# Altium schematic sheet SFP_10GbE_Port0.SchDoc: =ProjectTitle
size A3; Author: Jaime I. Chait; Organization: NWES LLC; Address1: 111 SW 5th Ave, STE 3150; Address2: Portland, OR 97204; SheetNumber: 17; SheetTotal: 19
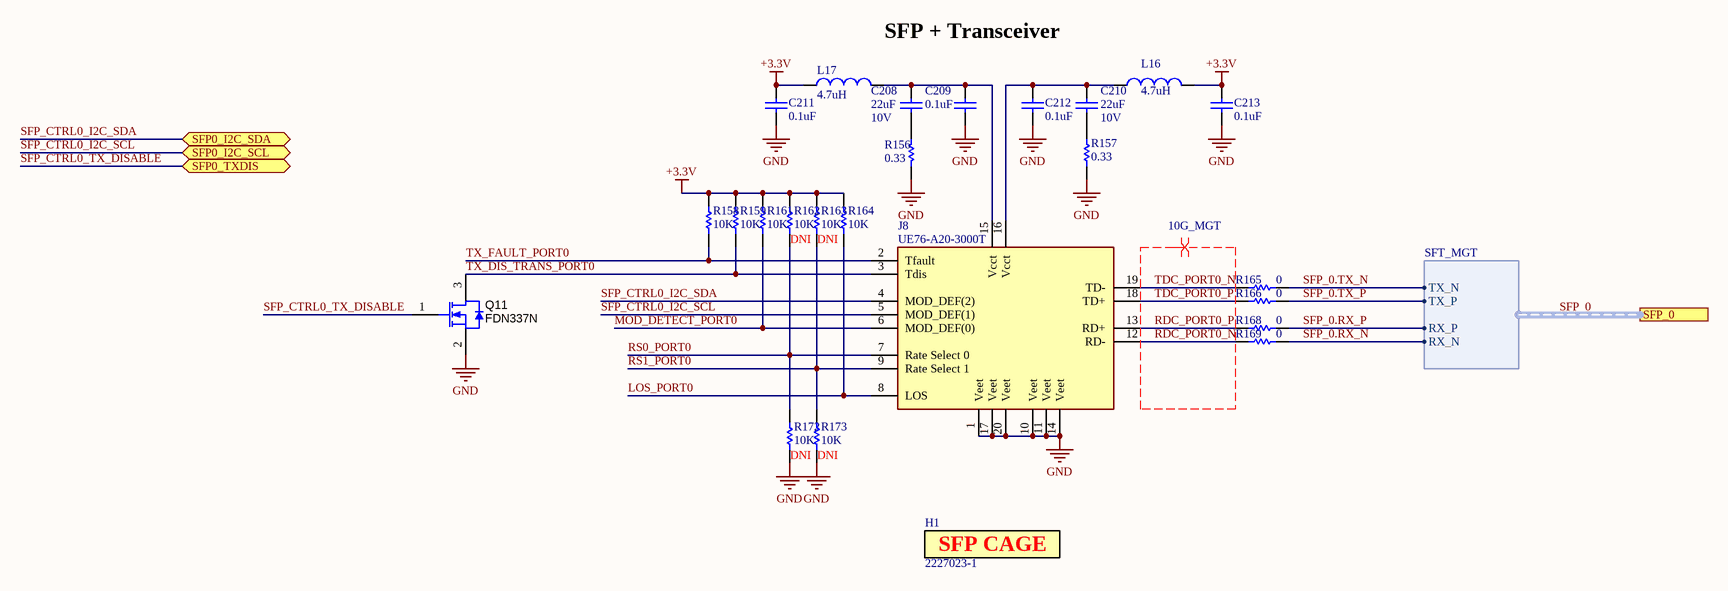
[diagram p0: SFP_10GbE_Port0.SchDoc]

## Parts
C208  22uF  Voltage Rating: 10V  [CAPC1608X100N]
C209  0.1uF  [CAPC1005X55USR]
C210  22uF  Voltage Rating: 10V  [CAPC1608X100N]
C211  0.1uF  [CAPC1005X55USR]
C212  0.1uF  [CAPC1005X55USR]
C213  0.1uF  [CAPC1005X55USR]
H1  2227023-1  [TE_2227023-1]
J8  UE76-A20-3000T  [AMPHENOL_UE76-A20-3000T]
L16  4.7uH  [DFE252012P]
L17  4.7uH  [DFE252012P]
Q11  FDN337N  [SOT-23]
R156  0.33  [RESC1608X55N]
R157  0.33  [RESC1608X55N]
R158  10K  [RESC1005X40USR]
R159  10K  [RESC1005X40USR]
R161  10K  [RESC1005X40USR]
R162  10K  [RESC1005X40USR]
R163  10K  [RESC1005X40USR]
R164  10K  [RESC1005X40USR]
R165  0  [RESC1005X40USR]
R166  0  [RESC1005X40USR]
R168  0  [RESC1005X40USR]
R169  0  [RESC1005X40USR]
R172  10K  [RESC1005X40USR]
R173  10K  [RESC1005X40USR]

## Ports
SFP0_I2C_SCL (bidir), SFP0_I2C_SDA (bidir), SFP0_TXDIS (bidir), SFP_0 (harness SFT_MGT)

## Harnesses
SFT_MGT: TX_N, TX_P, RX_P, RX_N

## Nets
+3.3V: C211.2 C213.2 L16.2 L17.2 R158.2 R159.2 R161.2 R162.2 R163.2 R164.2
GND: C209.1 C211.1 C212.1 C213.1 J8.1(Veet) J8.10(Veet) J8.11(Veet) J8.14(Veet) J8.17(Veet) J8.20(Veet) Q11.2(S) R156.1 R157.1 R172.1 R173.1
LOS_PORT0: J8.8(LOS) R164.1
MOD_DETECT_PORT0: J8.6(MOD_DEF(0)) R161.1
RDC_PORT0_N: J8.12(RD-) R169.1
RDC_PORT0_P: J8.13(RD+) R168.1
RS0_PORT0: J8.7(Rate_Select_0) R162.1 R172.2
RS1_PORT0: J8.9(Rate_Select_1) R163.1 R173.2
SFP_0.RX_N: R169.2 ; port SFP_0.RX_N
SFP_0.RX_P: R168.2 ; port SFP_0.RX_P
SFP_0.TX_N: R165.2 ; port SFP_0.TX_N
SFP_0.TX_P: R166.2 ; port SFP_0.TX_P
SFP_CTRL0_I2C_SCL: J8.5(MOD_DEF(1)) ; port SFP0_I2C_SCL
SFP_CTRL0_I2C_SDA: J8.4(MOD_DEF(2)) ; port SFP0_I2C_SDA
SFP_CTRL0_TX_DISABLE: Q11.1(G) ; port SFP0_TXDIS
TDC_PORT0_N: J8.19(TD-) R165.1
TDC_PORT0_P: J8.18(TD+) R166.1
TX_DIS_TRANS_PORT0: J8.3(Tdis) Q11.3(D) R159.1
TX_FAULT_PORT0: J8.2(Tfault) R158.1
NetC208_1: C208.1 C209.2 J8.15(Vcct) L17.1
NetC208_2: C208.2 R156.2
NetC210_1: C210.1 C212.2 J8.16(Vcct) L16.1
NetC210_2: C210.2 R157.2

## Buses and harness runs
harness SFP_0 = port SFP_0

## Layout directives
differential pair; differential pair class 10G_MGT: RDC_PORT0_N, RDC_PORT0_P, TDC_PORT0_N, TDC_PORT0_P

## Notes on the sheet
- SFP + Transceiver
- (near R162) DNI
- (near R163) DNI
- (near R172) DNI
- (near R173) DNI
- Title
- Size:
- Date:
- A4
- Number:
- Time:
- Revision:
- Sheet
- of
- File:
- (in symbol TE_2227023-1) SFP CAGE

## Library data of the parts
C208 C210 = CAP CER 22UF 10V X5R 0603: Multilayer Ceramic Capacitor, 22 uF, 10 V, ± 20%, X5R, 0603 [1608 Metric]; Manufacturer: TDK; Manufacturer Part Number: C1608X5R1A226M080AC; Supplier 1: Digi-Key; RoHS: Yes; Category: Ceramic Capacitors; Stock 1: 4100481; Pricing 1: 1=0.45000, 10=0.31300, 50=0.21920, 100=0.18790, 500=0.14090, 1000=0.11898 (USD); Mount: Surface Mount; Case/Package: 0603; Case Code (Metric): 1608; Case Code (Imperial): 0603; Dielectric Material: Ceramic; Weight: 7.1E-05oz; Min Operating Temperature: -55°C; Max Operating Temperature: 85°C; Tolerance: 20%; Capacitance: 22uF; Packaging: Tape and Reel; Voltage Rating (DC): 10V; Termination: SMD/SMT; Series: C; Package Quantity: 4000; Dielectric: X5R; Resistor Type: Ceramic; Length: 1.6mm; Width: 0.8mm; Height: 0.8mm; Thickness: 0.035inch; Depth: 0.8mm; Reach SVHC Compliant: Yes; Lead Free: Lead Free; RoHS Compliant: Yes; ComponentLink1URL: https://datasheet.ciiva.com/6274/tdkmlcccaprange-6274860.pdf?src-supplier=Digi-Key; ComponentLink1Description: https://datasheet.ciiva.com/6274/tdkmlcccaprange-6274860.pdf?src-supplier=Digi-Key; ComponentLink2URL: https://datasheet.ciiva.com/6274/tdkmlcccaprange-6274859.pdf?src-supplier=Digi-Key; ComponentLink2Description: https://datasheet.ciiva.com/6274/tdkmlcccaprange-6274859.pdf?src-supplier=Digi-Key; ComponentLink3URL: https://datasheet.ciiva.com/6274/tdkmlcccaprange-6274861.pdf?src-supplier=Digi-Key; ComponentLink3Description: https://datasheet.ciiva.com/6274/tdkmlcccaprange-6274861.pdf?src-supplier=Digi-Key; ComponentLink4URL: https://datasheet.ciiva.com/24216/mlcc-commercial-general-en-24216575.pdf?src-supplier=Mouser; ComponentLink4Description: https://datasheet.ciiva.com/24216/mlcc-commercial-general-en-24216575.pdf?src-supplier=Mouser; Supplier Part Number 1: 445-9077-1-ND
C209 C211-C213 = CAP CER 0.1UF 25V X5R 0402: Manufacturer Part Number: CL05A104KA5NNNC; Manufacturer: Samsung Electro-Mechanics; Supplier Part Number 1: 1276-1043-1-ND; Package: 0402; Height: 0.55mm; Supplier 1: Digi-Key; value: 0.1uF
H1 = TE_2227023-1: Connector Accessories 1 Port SFP Cage Press Fit Right Angle Through Hole Nickel Tray; Manufacturer: TE Connectivity AMP; Data Rate: 4Gbps; Number of Ports: 1; PCB Thickness: 0.059inch; Tail Length: 3mm; Supplier 1: Digi-Key; Supplier Part Number 1: A120615-ND; Manufacturer Part Number: 2227023-1; RoHS: Yes; Category: Connectors; Stock: 3865; Pricing: 1=2.23000, 24=1.98875, 48=1.97854, 96=1.95823, 240=1.79675, 456=1.78667, 960=1.62516, 2400=1.45356 (USD); Mounting Technology: Through Hole; Packaging: Tray; Termination: Press-Fit; Connector Type: SFP; Features: Shielded; Series: -; Number of Positions: 1; ELV: Compliant; RoHS Compliant: Yes; ComponentLink1URL: https://datasheet.ciiva.com/45236/eng-cd-2227023-1-45236427.pdf?src-supplier=Avnet; ComponentLink1Description: https://datasheet.ciiva.com/45236/eng-cd-2227023-1-45236427.pdf?src-supplier=Avnet
J8 = UE76-A20-3000T: Conn SFP+ RCP 20 POS 0.8mm Solder RA SMD 20 Terminal 1 Port T/R; Manufacturer: Amphenol Communications Solutions; Supplier 1: Future Electronics; Manufacturer Part Number: UE76-A20-3000T; RoHS: No; Stock 1: 500; Pricing 1: 500=0.81500, 1000=0.79500, 1500=0.78000, 2000=0.77500, 2500=0.75000 (USD); Supplier Part Number 1: 9135124
L16 L17 = FIXED IND 4.7UH 2A 200 MOHM SMD: Manufacturer: Murata; Manufacturer Part Number: DFE252012P-4R7M=P2; Core Material: Ferrite; Shielding: Shielded; DC Resistance (DCR): 200mR; Test Frequency: 1MHz; Max DC Current: 1.4A; Tolerance: 20%; Supplier 1: Digi-Key; RoHS: Yes; Category: Fixed Inductors; Stock 1: 151905; Pricing 1: 1=0.31000, 10=0.27500, 25=0.24040, 50=0.20600, 100=0.18890, 250=0.17168, 500=0.16140, 1000=0.12362 (USD); Mount: Surface Mount; Case/Package: 1008; Case Code (Metric): 2520; Case Code (Imperial): 1008; Min Operating Temperature: -40°C; Max Operating Temperature: 125°C; Inductance: 4.7uH; Packaging: Tape and Reel; Resistor Type: Wirewound,Metal Alloy; Current Rating: 2A; Length: 0.098inch; Width: 0.079inch; Height - Seated (Max): 0.047inch; Depth: 2mm; RoHS Compliant: Yes; ComponentLink1URL: http://www.farnell.com/datasheets/2550138.pdf?src-supplier=Farnell; ComponentLink1Description: http://www.farnell.com/datasheets/2550138.pdf?src-supplier=Farnell; ComponentLink2URL: http://www.toko.co.jp/products/pdf/inductors/dfe252012p.pdf?src-supplier=Avnet; ComponentLink2Description: http://www.toko.co.jp/products/pdf/inductors/dfe252012p.pdf?src-supplier=Avnet; ComponentLink3URL: http://www.farnell.com/datasheets/2550138.pdf?src-supplier=Newark; ComponentLink3Description: http://www.farnell.com/datasheets/2550138.pdf?src-supplier=Newark; ComponentLink4URL: http://www.murata.com/~/media/webrenewal/products/inductor/chip/tokoproducts/wirewoundmetalalloychiptype/m_dfe252012p.ashx?src-supplier=Digi-Key; ComponentLink4Description: http://www.murata.com/~/media/webrenewal/products/inductor/chip/tokoproducts/wirewoundmetalalloychiptype/m_dfe252012p.ashx?src-supplier=Digi-Key; ComponentLink5URL: https://www.murata.com/~/media/webrenewal/products/inductor/chip/tokoproducts/wirewoundmetalalloychiptype/m_dfe252012p.ashx?src-supplier=Digi-Key; ComponentLink5Description: https://www.murata.com/~/media/webrenewal/products/inductor/chip/tokoproducts/wirewoundmetalalloychiptype/m_dfe252012p.ashx?src-supplier=Digi-Key; Supplier Part Number 1: 490-10651-1-ND
Q11 = MOSFET N-CH 30V 2.2A SUPERSOT3: MOSFET N-CH 30V 2.2A SSOT3; Manufacturer: ON Semiconductor / Fairchild; Drain to Source Resistance: 65mR; Gate to Source Voltage (Vgs): 8V; Power Dissipation: 500mW; Turn-Off Delay Time: 17ns; Element Configuration: Single; Rise Time: 10ns; Turn-On Delay Time: 4ns; Input Capacitance: 300pF; Number of Elements: 1; Threshold Voltage: 700mV; Polarity: N-CHANNEL; Supplier 1: Digi-Key; Manufacturer Part Number: FDN337N; RoHS: Yes; Category: MOSFETs; Stock 1: 48367; Pricing 1: 1=0.49000, 10=0.42000, 100=0.31350, 500=0.24636, 1000=0.19037 (USD); Mount: Surface Mount; Case/Package: TO-236-3; Number of Pins: 3; Contact Plating: Tin,Matte; Weight: 0.03g; Min Operating Temperature: -55°C; Max Operating Temperature: 150°C; Continuous Drain Current (ID): 2.2A; Packaging: Tape and Reel; Drain to Source Breakdown Voltage: 30V; Max Power Dissipation: 500mW; Drain to Source Voltage (Vdss): 30V; Fall Time: 10ns; Package Quantity: 3000; Rds On Max: 65mR; Voltage Rating (DC): 30V; Current Rating: 2.2A; On-State Resistance: 65mR; Series: -; Drain-source On Resistance-Max: 65mR; Dual Supply Voltage: 30V; Termination: SMD/SMT; Nominal Vgs: 700mV; Length: 2.92mm; Width: 3.05mm; Height: 0.94mm; Lead Free: Lead Free; RoHS Compliant: Yes; Reach SVHC Compliant: Yes; ComponentLink1URL: https://datasheet.ciiva.com/14092/fdn337n-eng-datasheet-14092051.pdf?src-supplier=Distrelec; ComponentLink1Description: https://datasheet.ciiva.com/14092/fdn337n-eng-datasheet-14092051.pdf?src-supplier=Distrelec; ComponentLink2URL: https://datasheet.ciiva.com/4442/fdn337n-44286-4442315.pdf?src-supplier=Mouser; ComponentLink2Description: https://datasheet.ciiva.com/4442/fdn337n-44286-4442315.pdf?src-supplier=Mouser; ComponentLink3URL: https://datasheet.ciiva.com/19470/871017-19470804.pdf?src-supplier=Jameco; ComponentLink3Description: https://datasheet.ciiva.com/19470/871017-19470804.pdf?src-supplier=Jameco; ComponentLink4URL: https://datasheet.ciiva.com/6037/fdn337n-6037720.pdf?src-supplier=Farnell; ComponentLink4Description: https://datasheet.ciiva.com/6037/fdn337n-6037720.pdf?src-supplier=Farnell; ComponentLink5URL: https://datasheet.ciiva.com/22681/220571-22681884.pdf?src-supplier=Element14; ComponentLink5Description: https://datasheet.ciiva.com/22681/220571-22681884.pdf?src-supplier=Element14; ComponentLink6URL: https://datasheet.ciiva.com/22655/220571-22655333.pdf?src-supplier=Element14; ComponentLink6Description: https://datasheet.ciiva.com/22655/220571-22655333.pdf?src-supplier=Element14; ComponentLink7URL: https://datasheet.ciiva.com/7968/220571-7968126.pdf?src-supplier=Element14; ComponentLink7Description: https://datasheet.ciiva.com/7968/220571-7968126.pdf?src-supplier=Element14; ComponentLink8URL: https://datasheet.ciiva.com/8115/fdn337n-8115069.pdf?src-supplier=Avnet; ComponentLink8Description: https://datasheet.ciiva.com/8115/fdn337n-8115069.pdf?src-supplier=Avnet; ComponentLink9URL: https://datasheet.ciiva.com/16931/fdn337n-16931214.pdf?src-supplier=Future+Electronics; ComponentLink9Description: https://datasheet.ciiva.com/16931/fdn337n-16931214.pdf?src-supplier=Future+Electronics; ComponentLink10URL: https://datasheet.ciiva.com/8115/fdn337n-8115063.pdf?src-supplier=Avnet; ComponentLink10Description: https://datasheet.ciiva.com/8115/fdn337n-8115063.pdf?src-supplier=Avnet; ComponentLink11URL: https://datasheet.ciiva.com/931/fdn337n-931876.pdf?src-supplier=Digi-Key; ComponentLink11Description: https://datasheet.ciiva.com/931/fdn337n-931876.pdf?src-supplier=Digi-Key; ComponentLink12URL: https://datasheet.ciiva.com/931/fdn337n-931877.pdf?src-supplier=Digi-Key; ComponentLink12Description: https://datasheet.ciiva.com/931/fdn337n-931877.pdf?src-supplier=Digi-Key; ComponentLink13URL: https://datasheet.ciiva.com/931/fdn337n-931875.pdf?src-supplier=Digi-Key; ComponentLink13Description: https://datasheet.ciiva.com/931/fdn337n-931875.pdf?src-supplier=Digi-Key; Supplier Part Number 1: FDN337NCT-ND
R156 R157 = RES 0.33 OHM 1% 1/10W 0603: Manufacturer: Panasonic Electronic Components; Manufacturer Part Number: ERJ-3RQFR33V; Supplier Part Number 1: P.33AJCT-ND; Supplier 1: Digi-Key; Height: 0.4mm; Package: 0402; value: 0.33
R158 R159 R161-R164 R172 R173 = RES 10K OHM 1% 1/16W 0402: Manufacturer: YAGEO; Manufacturer Part Number: RC0402FR-0710KL; Supplier Part Number 1: 311-10.0KLRCT-ND; Package: 0402; Height: 0.4mm; Supplier 1: Digi-Key; value: 10K; Tolerance: ±1%
R165 R166 R168 R169 = RES 0 OHM JUMPER 1/16W 0402: Manufacturer: Yageo; Manufacturer Part Number: RC0402JR-070RL; Supplier Part Number 1: 311-0.0JRTR-ND; Package: 0402; Height: 0.4mm; Supplier 1: Digi-Key; value: 0